# Altium project 自制Linux板.PrjPcb
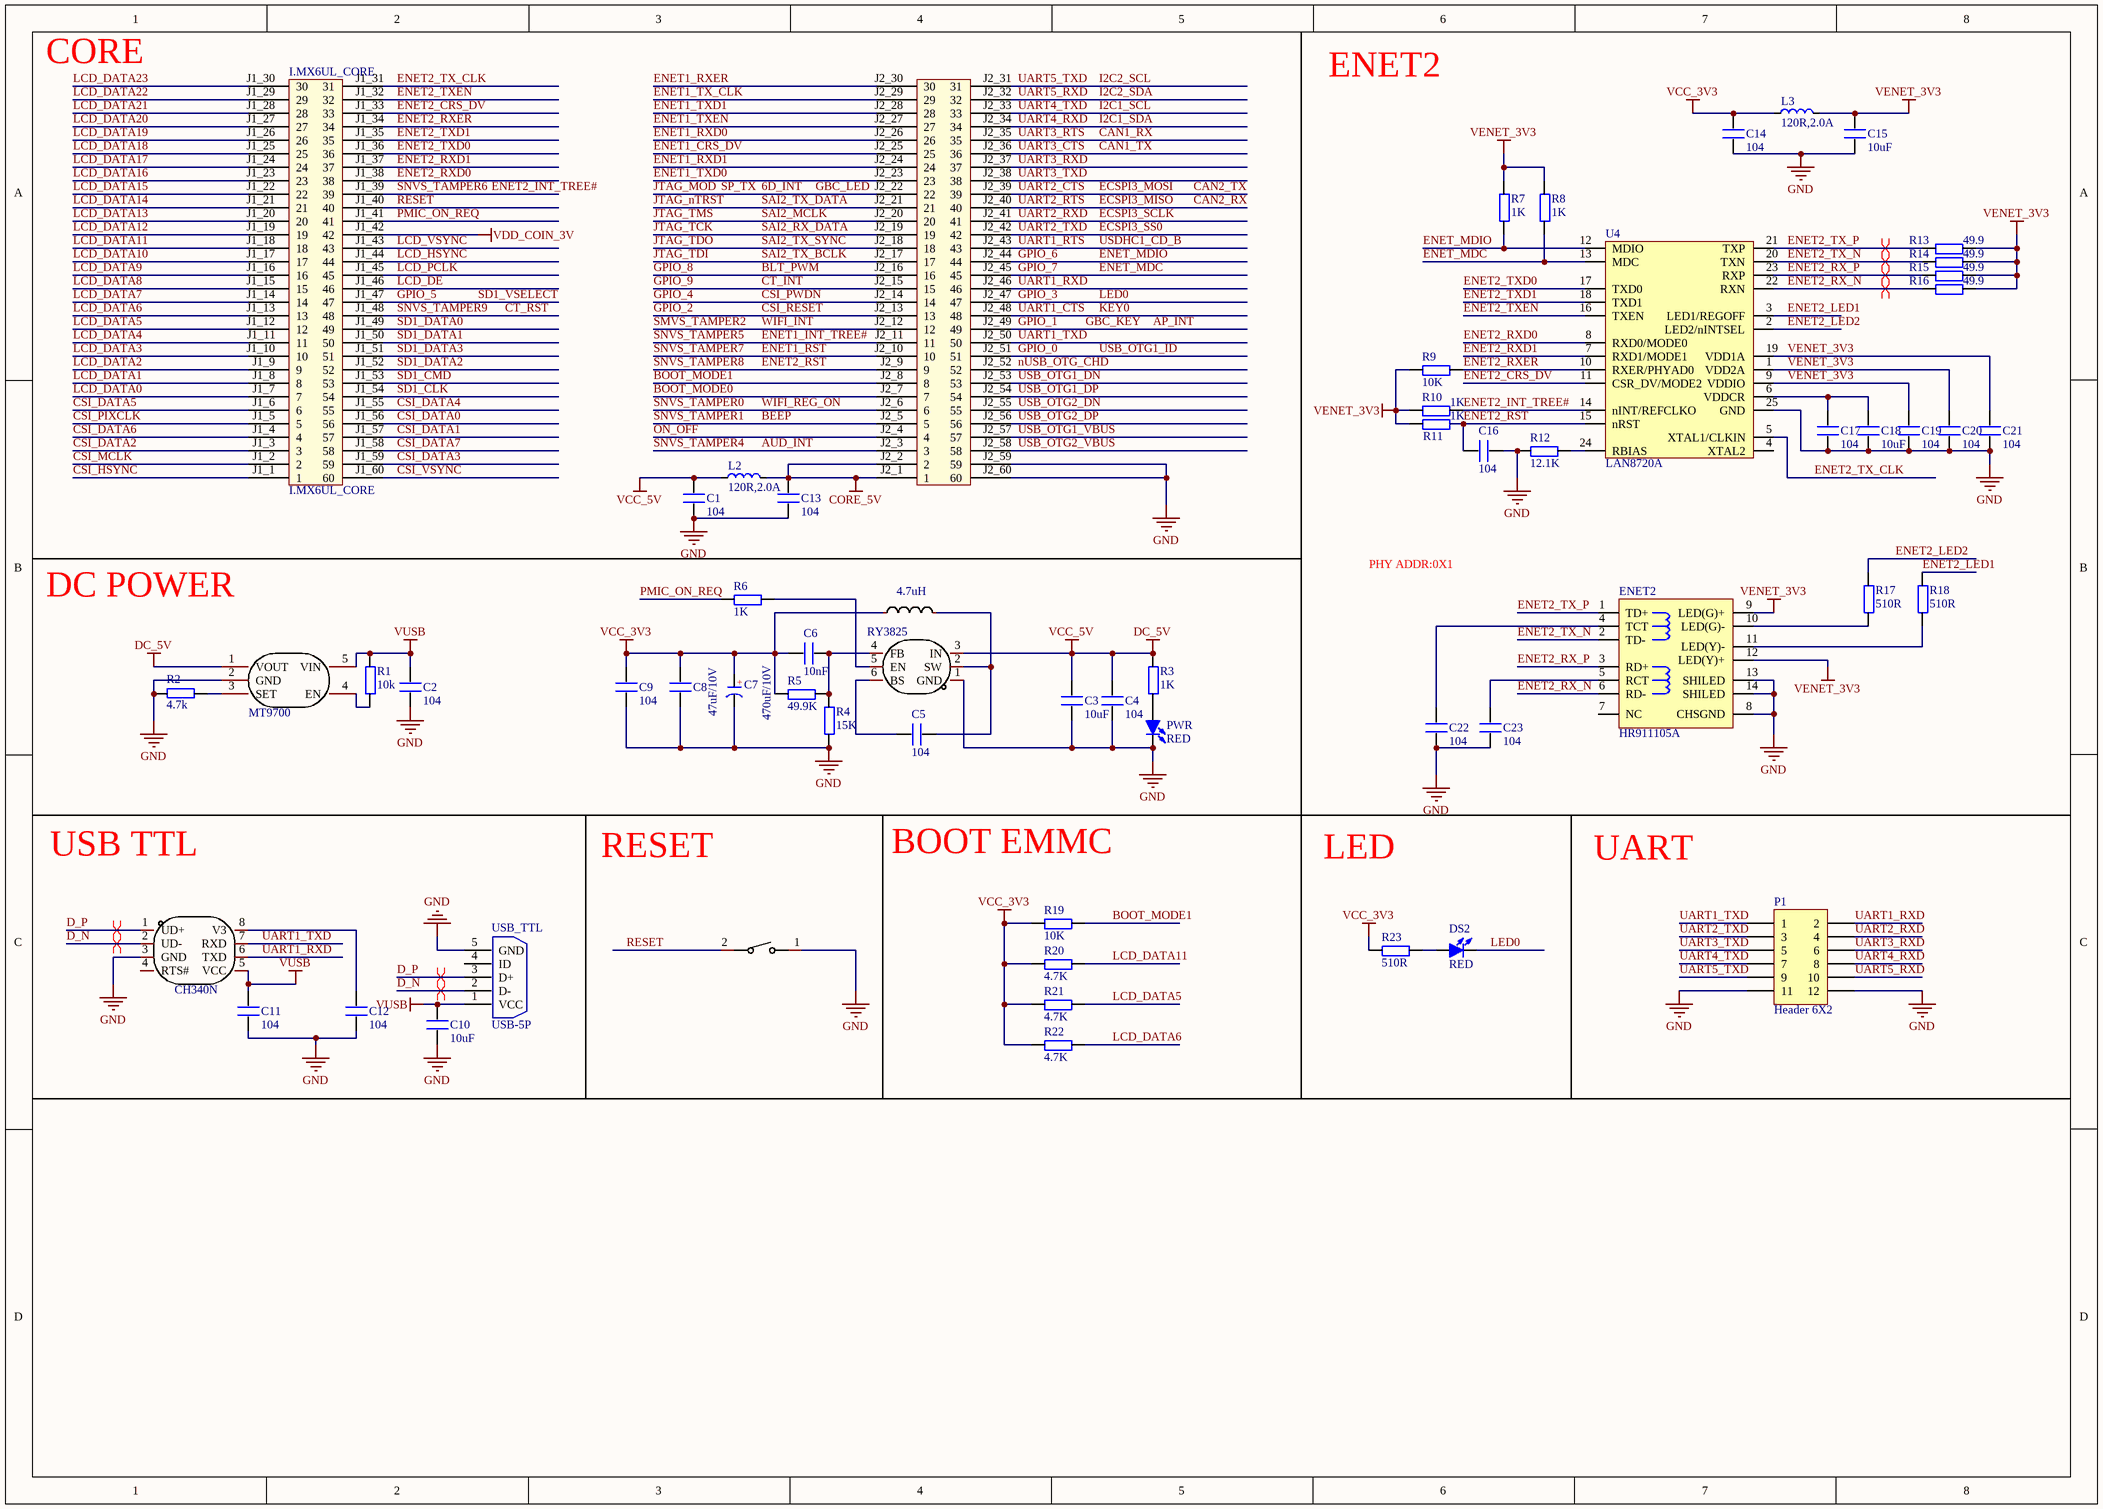
[diagram p0: Sheet1.SchDoc]
1 sheet, 60 parts. Net scope: global (net labels, ports and power ports of the same name join across sheets).
Board file: PCB1.PcbDoc

## Sheet Sheet1.SchDoc
size A3; SheetNumber: 1; SheetTotal: 1

### Parts
1  4.7uH  [IND-SMD_L5.4-W5.2_FXL0530]
C1  104  [C 0603]
C2  104  [C 0603]
C3  10uF  [C 0603]
C4  104  [C 0603]
C5  104  [C 0603]
C6  10nF  [C 0603]
C7  470uF/10V  [CM D(6.3*7.7)]
C8  47uF/10V  [1206]
C9  104  [C 0603]
C10  10uF  [C 0603]
C11  104  [C 0603]
C12  104  [C 0603]
C13  104  [C 0603]
C14  104  [C 0603]
C15  10uF  [C 0603]
C16  104  [C 0603]
C17  104  [C 0603]
C18  10uF  [C 0603]
C19  104  [C 0603]
C20  104  [C 0603]
C21  104  [C 0603]
C22  104  [C 0603]
C23  104  [C 0603]
DS2  RED  [LED 0603B]
ENET2  HR911105A  [RJ-45A12]
I.MX6UL_CORE  I.MX6UL_CORE  [I.MX6UL_CORE]
L2  120R,2.0A  [L 0603]
L3  120R,2.0A  [L 0603]
P1  Header 6X2  [HDR2X6]
PWR  RED  [LED 0603B]
R1  10k  [R 0603]
R2  4.7k  [R 0603]
R3  1K  [R 0603]
R4  15K  [R 0603]
R5  49.9K  [R 0603]
R6  1K  [R 0603]
R7  1K  [R 0603]
R8  1K  [R 0603]
R9  10K  [R 0603]
R10  1K  [R 0603]
R11  1K  [R 0603]
R12  12.1K  [R 0603]
R13  49.9  [R 0603]
R14  49.9  [R 0603]
R15  49.9  [R 0603]
R16  49.9  [R 0603]
R17  510R  [R 0603]
R18  510R  [R 0603]
R19  10K  [R 0603]
R20  4.7K  [R 0603]
R21  4.7K  [R 0603]
R22  4.7K  [R 0603]
R23  510R  [R 0603]
SW  TS3625A-HT  [SW-SMD_L6.1-W3.7-LS7.9]  (value not drawn)
U1  MT9700  [SOT-23-5_L3.0-W1.7-P0.95-LS2.8-BR]
U2  RY3825  [SOT-23-6_L2.9-W1.6-P0.95-LS2.8-BR]
U3  CH340N  [SOP-8_L4.9-W3.9-P1.27-LS6.0-BL]
U4  LAN8720A  [QFN24]
USB_TTL  USB-5P  [USB-MINI-A]

### Nets
CORE_5V: C13.2 I.MX6UL_CORE.J2_1(1) I.MX6UL_CORE.J2_2(2) L2.2
DC_5V: C1.2 C3.2 C4.2 L2.1 R3.2 U1.1(VOUT) U2.3(IN)  [also labelled VCC_5V]
GND: C1.1 C2.1 C3.1 C4.1 C7.2(K) C8.1 C9.1 C10.1 C11.1 C12.1 C13.1 C14.1 C15.1 C16.2 C17.1 C18.1 C19.1 C20.1 C21.1 C22.1 C23.1 ENET2.8(CHSGND) ENET2.13(SHILED) ENET2.14(SHILED) I.MX6UL_CORE.J2_59(59) I.MX6UL_CORE.J2_60(60) P1.11 P1.12 PWR.2(K) R2.2 R4.1 R12.1 SW.1(A) U1.2(GND) U2.1(GND) U3.3(GND) U4.25(GND) USB_TTL.5(GND)
VCC_3V3: 1.1 C6.1 C7.1(A) C8.2 C9.2 C14.2 L3.1 R5.1 R19.1 R20.1 R21.1 R22.1 R23.1
VDD_COIN_3V: I.MX6UL_CORE.J1_42(42)
VENET_3V3: C15.2 C19.2 C20.2 C21.2 ENET2.9(LED(G)+) ENET2.12(LED(Y)+) L3.2 R7.2 R8.2 R9.1 R10.1 R11.1 R13.2 R14.2 R15.2 R16.2 U4.1(VDD2A) U4.9(VDDIO) U4.19(VDD1A)
VUSB: C2.2 C10.2 C11.2 R1.2 U1.5(VIN) U3.5(VCC) USB_TTL.1(VCC)
6D_INT: I.MX6UL_CORE.J2_22(22)  [also labelled GBC_LED, JTAG_MOD, SP_TX]
AP_INT: I.MX6UL_CORE.J2_49(49)  [also labelled GBC_KEY, GPIO_1]
AUD_INT: I.MX6UL_CORE.J2_3(3)  [also labelled SNVS_TAMPER4]
BEEP: I.MX6UL_CORE.J2_5(5)  [also labelled SNVS_TAMPER1]
BLT_PWM: I.MX6UL_CORE.J2_16(16)  [also labelled GPIO_8]
BOOT_MODE0: I.MX6UL_CORE.J2_7(7)
BOOT_MODE1: I.MX6UL_CORE.J2_8(8) R19.2
CAN1_RX: I.MX6UL_CORE.J2_35(35)  [also labelled UART3_RTS]
CAN1_TX: I.MX6UL_CORE.J2_36(36)  [also labelled UART3_CTS]
CAN2_RX: I.MX6UL_CORE.J2_40(40)  [also labelled ECSPI3_MISO, UART2_RTS]
CAN2_TX: I.MX6UL_CORE.J2_39(39)  [also labelled ECSPI3_MOSI, UART2_CTS]
CSI_DATA0: I.MX6UL_CORE.J1_56(56)
CSI_DATA1: I.MX6UL_CORE.J1_57(57)
CSI_DATA2: I.MX6UL_CORE.J1_3(3)
CSI_DATA3: I.MX6UL_CORE.J1_59(59)
CSI_DATA4: I.MX6UL_CORE.J1_55(55)
CSI_DATA5: I.MX6UL_CORE.J1_6(6)
CSI_DATA6: I.MX6UL_CORE.J1_4(4)
CSI_DATA7: I.MX6UL_CORE.J1_58(58)
CSI_HSYNC: I.MX6UL_CORE.J1_1(1)
CSI_MCLK: I.MX6UL_CORE.J1_2(2)
CSI_PIXCLK: I.MX6UL_CORE.J1_5(5)
CSI_PWDN: I.MX6UL_CORE.J2_14(14)  [also labelled GPIO_4]
CSI_RESET: I.MX6UL_CORE.J2_13(13)  [also labelled GPIO_2]
CSI_VSYNC: I.MX6UL_CORE.J1_60(60)
CT_INT: I.MX6UL_CORE.J2_15(15)  [also labelled GPIO_9]
CT_RST: I.MX6UL_CORE.J1_48(48)  [also labelled SNVS_TAMPER9]
D_N: U3.2(UD-) USB_TTL.2(D-)
D_P: U3.1(UD+) USB_TTL.3(D+)
ECSPI3_SCLK: I.MX6UL_CORE.J2_41(41) P1.4  [also labelled UART2_RXD]
ECSPI3_SS0: I.MX6UL_CORE.J2_42(42) P1.3  [also labelled UART2_TXD]
ENET1_CRS_DV: I.MX6UL_CORE.J2_25(25)
ENET1_INT_TREE#: I.MX6UL_CORE.J2_11(11)  [also labelled SNVS_TAMPER5]
ENET1_RST: I.MX6UL_CORE.J2_10(10)  [also labelled SNVS_TAMPER7]
ENET1_RXD0: I.MX6UL_CORE.J2_26(26)
ENET1_RXD1: I.MX6UL_CORE.J2_24(24)
ENET1_RXER: I.MX6UL_CORE.J2_30(30)
ENET1_TX_CLK: I.MX6UL_CORE.J2_29(29)
ENET1_TXD0: I.MX6UL_CORE.J2_23(23)
ENET1_TXD1: I.MX6UL_CORE.J2_28(28)
ENET1_TXEN: I.MX6UL_CORE.J2_27(27)
ENET2_CRS_DV: I.MX6UL_CORE.J1_33(33) U4.11(CSR_DV/MODE2)
ENET2_INT_TREE#: I.MX6UL_CORE.J1_39(39) R10.2 U4.14(nINT/REFCLKO)  [also labelled SNVS_TAMPER6]
ENET2_LED1: R18.2 U4.3(LED1/REGOFF)
ENET2_LED2: R17.2 U4.2(LED2/nINTSEL)
ENET2_RST: C16.1 I.MX6UL_CORE.J2_9(9) R11.2 U4.15(nRST)  [also labelled SNVS_TAMPER8]
ENET2_RX_N: ENET2.6(RD-) R16.1 U4.22(RXN)
ENET2_RX_P: ENET2.3(RD+) R15.1 U4.23(RXP)
ENET2_RXD0: I.MX6UL_CORE.J1_38(38) U4.8(RXD0/MODE0)
ENET2_RXD1: I.MX6UL_CORE.J1_37(37) U4.7(RXD1/MODE1)
ENET2_RXER: I.MX6UL_CORE.J1_34(34) R9.2 U4.10(RXER/PHYAD0)
ENET2_TX_CLK: I.MX6UL_CORE.J1_31(31) U4.5(XTAL1/CLKIN)
ENET2_TX_N: ENET2.2(TD-) R14.1 U4.20(TXN)
ENET2_TX_P: ENET2.1(TD+) R13.1 U4.21(TXP)
ENET2_TXD0: I.MX6UL_CORE.J1_36(36) U4.17(TXD0)
ENET2_TXD1: I.MX6UL_CORE.J1_35(35) U4.18(TXD1)
ENET2_TXEN: I.MX6UL_CORE.J1_32(32) U4.16(TXEN)
ENET_MDC: I.MX6UL_CORE.J2_45(45) R8.1 U4.13(MDC)  [also labelled GPIO_7]
ENET_MDIO: I.MX6UL_CORE.J2_44(44) R7.1 U4.12(MDIO)  [also labelled GPIO_6]
GPIO_0: I.MX6UL_CORE.J2_51(51)  [also labelled USB_OTG1_ID]
GPIO_3: DS2.2(K) I.MX6UL_CORE.J2_47(47)  [also labelled LED0]
GPIO_5: I.MX6UL_CORE.J1_47(47)  [also labelled SD1_VSELECT]
I2C1_SCL: I.MX6UL_CORE.J2_33(33) P1.7  [also labelled UART4_TXD]
I2C1_SDA: I.MX6UL_CORE.J2_34(34) P1.8  [also labelled UART4_RXD]
I2C2_SCL: I.MX6UL_CORE.J2_31(31) P1.9  [also labelled UART5_TXD]
I2C2_SDA: I.MX6UL_CORE.J2_32(32) P1.10  [also labelled UART5_RXD]
JTAG_nTRST: I.MX6UL_CORE.J2_21(21)  [also labelled SAI2_TX_DATA]
JTAG_TCK: I.MX6UL_CORE.J2_19(19)  [also labelled SAI2_RX_DATA]
JTAG_TDI: I.MX6UL_CORE.J2_17(17)  [also labelled SAI2_TX_BCLK]
JTAG_TDO: I.MX6UL_CORE.J2_18(18)  [also labelled SAI2_TX_SYNC]
JTAG_TMS: I.MX6UL_CORE.J2_20(20)  [also labelled SAI2_MCLK]
KEY0: I.MX6UL_CORE.J2_48(48)  [also labelled UART1_CTS]
LCD_DATA0: I.MX6UL_CORE.J1_7(7)
LCD_DATA1: I.MX6UL_CORE.J1_8(8)
LCD_DATA2: I.MX6UL_CORE.J1_9(9)
LCD_DATA3: I.MX6UL_CORE.J1_10(10)
LCD_DATA4: I.MX6UL_CORE.J1_11(11)
LCD_DATA5: I.MX6UL_CORE.J1_12(12) R21.2
LCD_DATA6: I.MX6UL_CORE.J1_13(13) R22.2
LCD_DATA7: I.MX6UL_CORE.J1_14(14)
LCD_DATA8: I.MX6UL_CORE.J1_15(15)
LCD_DATA9: I.MX6UL_CORE.J1_16(16)
LCD_DATA10: I.MX6UL_CORE.J1_17(17)
LCD_DATA11: I.MX6UL_CORE.J1_18(18) R20.2
LCD_DATA12: I.MX6UL_CORE.J1_19(19)
LCD_DATA13: I.MX6UL_CORE.J1_20(20)
LCD_DATA14: I.MX6UL_CORE.J1_21(21)
LCD_DATA15: I.MX6UL_CORE.J1_22(22)
LCD_DATA16: I.MX6UL_CORE.J1_23(23)
LCD_DATA17: I.MX6UL_CORE.J1_24(24)
LCD_DATA18: I.MX6UL_CORE.J1_25(25)
LCD_DATA19: I.MX6UL_CORE.J1_26(26)
LCD_DATA20: I.MX6UL_CORE.J1_27(27)
LCD_DATA21: I.MX6UL_CORE.J1_28(28)
LCD_DATA22: I.MX6UL_CORE.J1_29(29)
LCD_DATA23: I.MX6UL_CORE.J1_30(30)
LCD_DE: I.MX6UL_CORE.J1_46(46)
LCD_HSYNC: I.MX6UL_CORE.J1_44(44)
LCD_PCLK: I.MX6UL_CORE.J1_45(45)
LCD_VSYNC: I.MX6UL_CORE.J1_43(43)
nUSB_OTG_CHD: I.MX6UL_CORE.J2_52(52)
ON_OFF: I.MX6UL_CORE.J2_4(4)
PMIC_ON_REQ: I.MX6UL_CORE.J1_41(41) R6.1
RESET: I.MX6UL_CORE.J1_40(40) SW.2(B)
SD1_CLK: I.MX6UL_CORE.J1_54(54)
SD1_CMD: I.MX6UL_CORE.J1_53(53)
SD1_DATA0: I.MX6UL_CORE.J1_49(49)
SD1_DATA1: I.MX6UL_CORE.J1_50(50)
SD1_DATA2: I.MX6UL_CORE.J1_52(52)
SD1_DATA3: I.MX6UL_CORE.J1_51(51)
SMVS_TAMPER2: I.MX6UL_CORE.J2_12(12)  [also labelled WIFI_INT]
SNVS_TAMPER0: I.MX6UL_CORE.J2_6(6)  [also labelled WIFI_REG_ON]
UART1_RTS: I.MX6UL_CORE.J2_43(43)  [also labelled USDHC1_CD_B]
UART1_RXD: I.MX6UL_CORE.J2_46(46) P1.2 U3.6(TXD)
UART1_TXD: I.MX6UL_CORE.J2_50(50) P1.1 U3.7(RXD)
UART3_RXD: I.MX6UL_CORE.J2_37(37) P1.6
UART3_TXD: I.MX6UL_CORE.J2_38(38) P1.5
USB_OTG1_DN: I.MX6UL_CORE.J2_53(53)
USB_OTG1_DP: I.MX6UL_CORE.J2_54(54)
USB_OTG1_VBUS: I.MX6UL_CORE.J2_57(57)
USB_OTG2_DN: I.MX6UL_CORE.J2_55(55)
USB_OTG2_DP: I.MX6UL_CORE.J2_56(56)
USB_OTG2_VBUS: I.MX6UL_CORE.J2_58(58)
Net1_2: 1.2 C5.2 U2.2(SW)
NetC5_1: C5.1 U2.6(BS)
NetC6_2: C6.2 R4.2 R5.2 U2.4(FB)
NetC12_2: C12.2 U3.8(V3)
NetC17_2: C17.2 C18.2 U4.6(VDDCR)
NetC22_2: C22.2 ENET2.4(TCT)
NetC23_2: C23.2 ENET2.5(RCT)
NetDS2_1: DS2.1(A) R23.2
NetENET2_10: ENET2.10(LED(G)-) R17.1
NetENET2_11: ENET2.11(LED(Y)-) R18.1
NetPWR_1: PWR.1(A) R3.1
NetR1_1: R1.1 U1.4(EN)
NetR2_1: R2.1 U1.3(SET)
NetR6_2: R6.2 U2.5(EN)
NetR12_2: R12.2 U4.24(RBIAS)

Not connected (* = marked no-connect by the designer): ENET2 7(NC); U3 4(RTS#); U4 4(XTAL2); USB_TTL 4(ID)

### Layout directives
differential pair: D_N, D_P, ENET2_RX_N, ENET2_RX_P, ENET2_TX_N, ENET2_TX_P

### Notes on the sheet
- CORE
- ENET2
- PHY ADDR:0X1
- DC POWER
- BOOT EMMC
- USB TTL
- RESET
- LED
- UART
- (in symbol C-CM) +

### Library data of the parts
1 = FXL0530-4R7-M: 4.7uH 5A; Manufacturer: cjiang(长江微电); Add into BOM: yes; Tolerance: ±20%; Rated Current: 4.5A; DC Resistance (DCR): 50mΩ; Name: 4.7uH; Symbol: FXL0530-4R7-M; Device: FXL0530-4R7-M; LCSC Part Name: 4.7uH ±20% 4.5A 50mΩ; Supplier Part: C177246; Manufacturer Part: FXL0530-4R7-M; Supplier Footprint: SMD,5.4x5.2x2.8mm; JLCPCB Part Class: Extended Part; Supplier: LCSC; Convert to PCB: yes; Value: 4.7uH; Saturation Current (Isat): 5A
C1-C6 C8-C23 = C
C7 = C-CM: 贴片电解电容; 版权归属: 源创客; BOM名称: 贴片电解电容; 学习资源: www.ooocke.com
DS2 PWR = LED-SMD: 贴片LED; 版权归属: 源创客; BOM名称: 贴片LED; 学习资源: www.ooocke.com
ENET2 = HR911105A: 带灯以太网接口; 版权归属: 源创客; BOM名称: 带灯以太网接口; 学习资源: www.ooocke.com
I.MX6UL_CORE = I.MX6UL核心板
L2 L3 = L: 小功率贴片电感磁珠; 版权归属: 源创客; BOM名称: 小功率贴片电感; 学习资源: www.ooocke.com
P1 = Header 6X2: Header, 6-Pin, Dual row; LatestRevisionDate: 17-Jul-2002; LatestRevisionNote: Re-released for DXP Platform.; Publisher: Altium Limited
R1-R23 = R
SW = TS3625A-HT: 红头按键; Manufacturer: SHOU HAN(首韩); Add into BOM: yes; Contact Current: 50mA; Voltage Rating (DC): 36V; Circuit: 单刀单掷; Actuator Style: 矩形按钮; Operating Force: 250gf@±30gf; Switch Length: 6.1mm; Switch Width: 3.65mm; Switch Height: 2.5mm; Name: TS3625A-HT; Symbol: TS3625A-HT; Device: TS3625A-HT; LCSC Part Name: 6.1*3.65*2.5mm 立贴 轻触开关; Supplier Part: C412368; Manufacturer Part: TS3625A-HT; Supplier Footprint: SMD,3.7x6.1mm; JLCPCB Part Class: Extended Part; Datasheet: https://atta.szlcsc.com/upload/public/pdf/source/20190816/C412368_ED995B38C5F41C525244887EA1991E6A.pdf; Supplier: LCSC; Convert to PCB: yes; Mounting Style: 立贴; With Lamp: -; Mechanical Life: -
U1 = MT9700: Manufacturer: 西安航天民芯; Add into BOM: yes; Name: MT9700; Symbol: MT9700; Device: MT9700; LCSC Part Name: MT9700; Supplier Part: C89855; Manufacturer Part: MT9700; Supplier Footprint: SOT-23-5; JLCPCB Part Class: Extended Part; Datasheet: https://atta.szlcsc.com/upload/public/pdf/source/20170418/1492481333031.pdf; Supplier: LCSC; Convert to PCB: yes
U2 = RY3825: Manufacturer: RYCHiP(蕊源); Add into BOM: yes; Name: RY3825; Symbol: RY3825; Device: RY3825; LCSC Part Name: RY3825 Buck, 4-18V, 2A, 600KHz, VFB 0.768V, SOT23-6; Supplier Part: C370760; Manufacturer Part: RY3825; Supplier Footprint: SOT-23-6; JLCPCB Part Class: Extended Part; Datasheet: https://atta.szlcsc.com/upload/public/pdf/source/20190329/C370760_D0EF026A080D1BEDE67CDD3EA56352B8.pdf; Supplier: LCSC; Convert to PCB: yes
U3 = CH340N_C2977777: Designer: U?; Symbol: CH340N_C2977777; Device: CH340N_C2977777
U4 = LAN8720: ETH PHY
USB_TTL = USB-5P: 微型USB母座; 版权归属: 源创客; BOM名称: 微型USB母座; 学习资源: www.ooocke.com